# EAGLE design slothbot_2.0 (EAGLE 9.6.2)

## Sheet 1 of 2: Logical Components
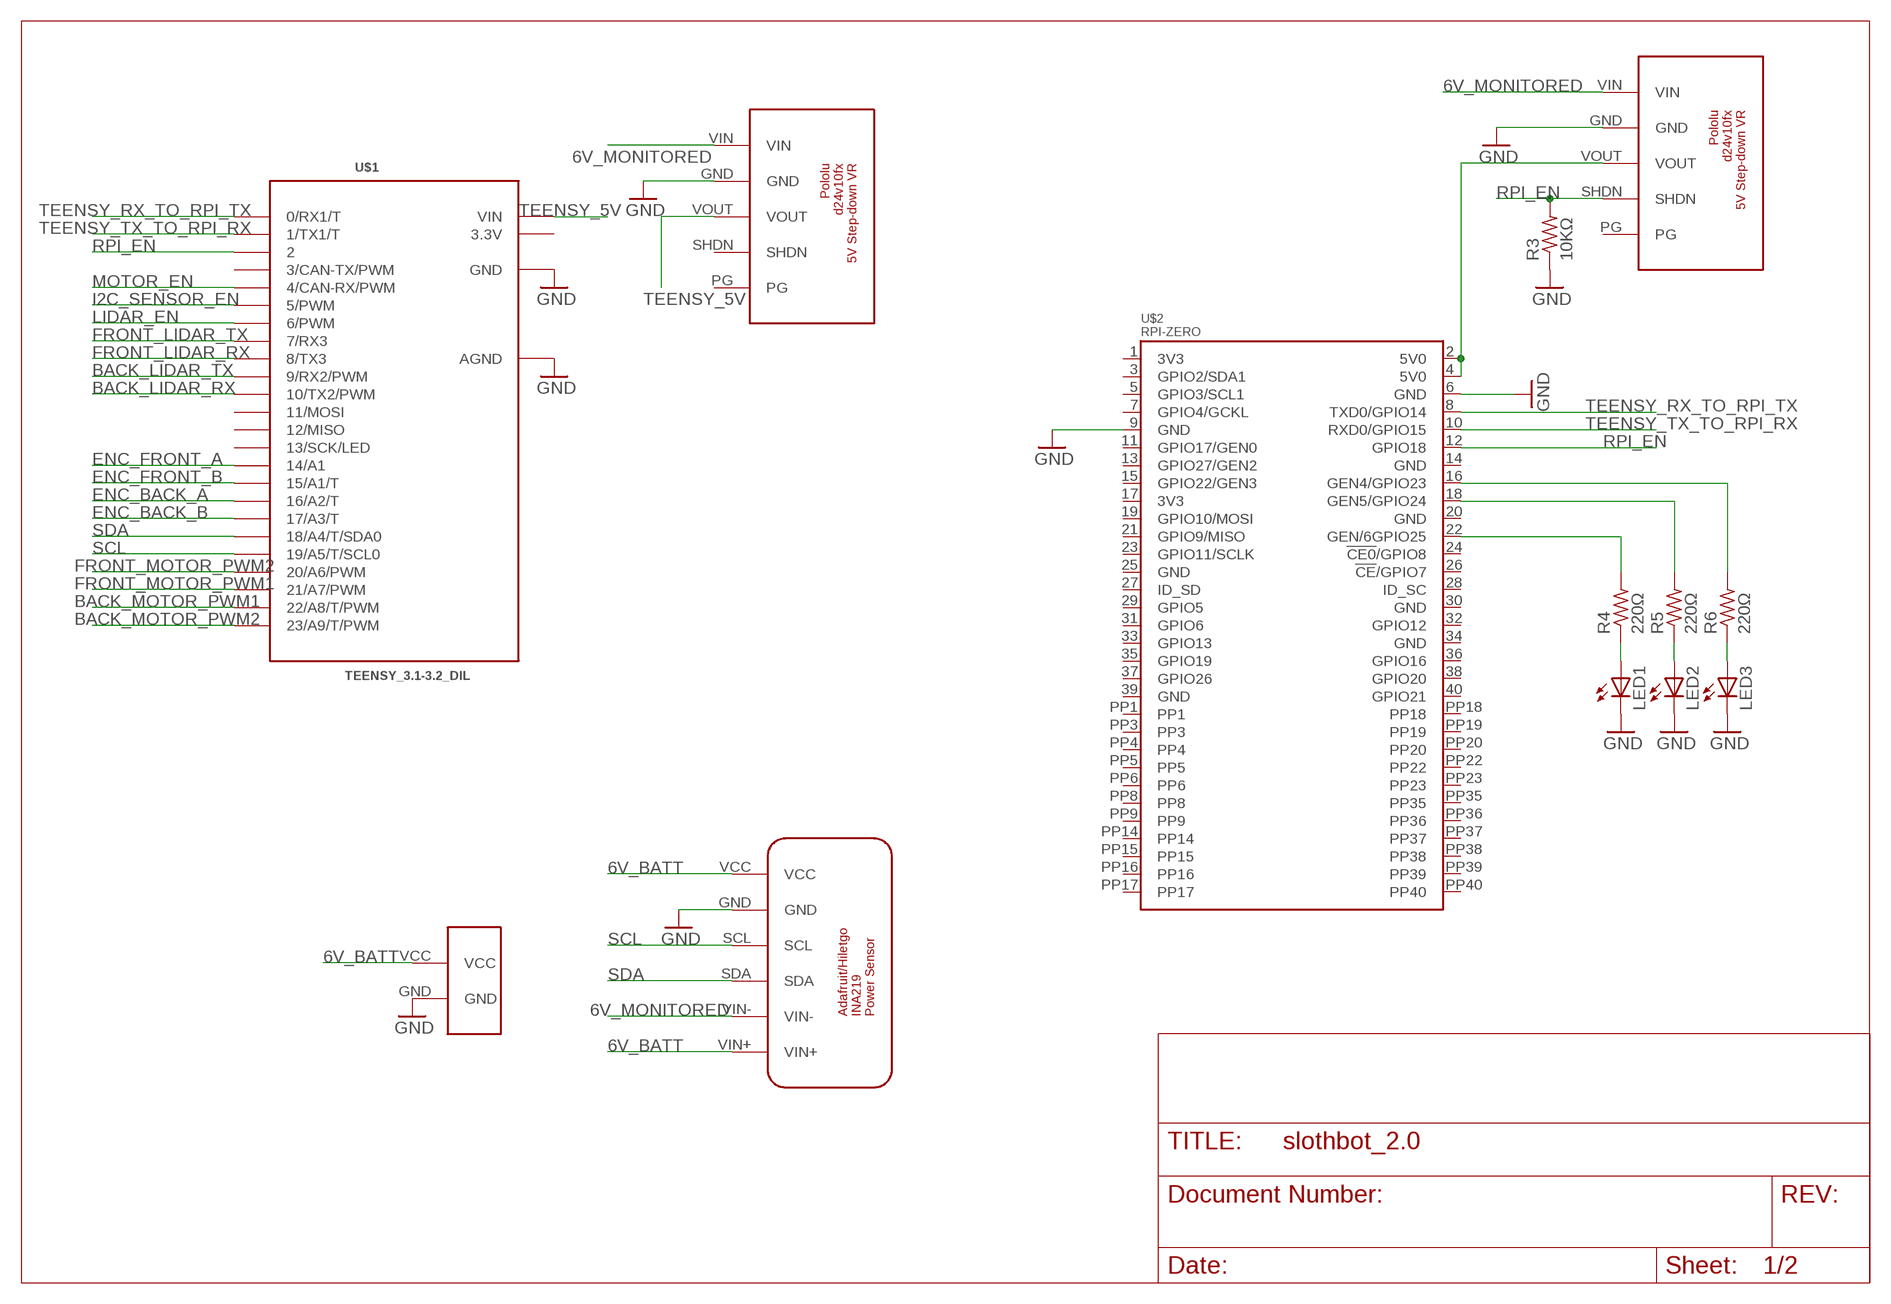
[diagram p0: schematic, sheet 1]

### Parts
LED1  LEDCHIPLED_0603  [CHIPLED_0603]
LED2  LEDCHIPLED_0603  [CHIPLED_0603]
LED3  LEDCHIPLED_0603  [CHIPLED_0603]
R3  10KΩ  R-US_R3216  [R3216]
R4  220Ω  R-US_R3216  [R3216]
R5  220Ω  R-US_R3216  [R3216]
R6  220Ω  R-US_R3216  [R3216]
U$1  TEENSY_3.1-3.2_DIL  [TEENSY_3.0-3.2&LC_DIL]
U$2  RPI-ZERO  [RASP_PI_ZERO_BOARD_FULL]
U$12  D24V10FX  [D24V10FX]
U$13  D24V10FX  [D24V10FX]
U$15  INA219  [INA219]
U$16  BATTERY_CONNECTOR  [BATTERY_CONNECTOR]

### Nets
5V0@1: U$2.2(5V0) U$2.4(5V0) U$13.VOUT
6V_BATT: U$15.VCC U$15.VIN+ U$16.VCC
6V_MONITORED: U$12.VIN U$13.VIN U$15.VIN- ; also sheet 2
BACK_LIDAR_RX: U$1.10(10/TX2/PWM) ; also sheet 2
BACK_LIDAR_TX: U$1.9(9/RX2/PWM) ; also sheet 2
BACK_MOTOR_PWM1: U$1.22/A8(22/A8/T/PWM) ; also sheet 2
BACK_MOTOR_PWM2: U$1.23/A9(23/A9/T/PWM) ; also sheet 2
ENC_BACK_A: U$1.16/A2(16/A2/T) ; also sheet 2
ENC_BACK_B: U$1.17/A3(17/A3/T) ; also sheet 2
ENC_FRONT_A: U$1.14/A0(14/A1) ; also sheet 2
ENC_FRONT_B: U$1.15/A1(15/A1/T) ; also sheet 2
FRONT_LIDAR_RX: U$1.8(8/TX3) ; also sheet 2
FRONT_LIDAR_TX: U$1.7(7/RX3) ; also sheet 2
FRONT_MOTOR_PWM1: U$1.21/A7(21/A7/PWM) ; also sheet 2
FRONT_MOTOR_PWM2: U$1.20/A6(20/A6/PWM) ; also sheet 2
GND: LED1.C LED2.C LED3.C R3.1 U$1.AGND U$1.GND U$2.6(GND) U$12.GND U$13.GND U$15.GND U$16.GND ; also sheet 2
GND@1: U$2.9(GND) ; supply symbol labelled GND
I2C_SENSOR_EN: U$1.5(5/PWM) ; also sheet 2
LIDAR_EN: U$1.6(6/PWM) ; also sheet 2
MOTOR_EN: U$1.4(4/CAN-RX/PWM) ; also sheet 2
N$6: LED1.A R4.1
N$10: LED2.A R5.1
N$11: LED3.A R6.1
N$12: R6.2 U$2.16(GEN4/GPIO23)
N$13: R5.2 U$2.18(GEN5/GPIO24)
N$14: R4.2 U$2.22(GEN/6GPIO25)
RPI_EN: R3.2 U$1.2 U$2.12(GPIO18) U$13.SHDN
SCL: U$1.19/A5(19/A5/T/SCL0) U$15.SCL ; also sheet 2
SDA: U$1.18/A4(18/A4/T/SDA0) U$15.SDA ; also sheet 2
TEENSY_5V: U$1.VIN U$12.VOUT ; also sheet 2
TEENSY_RX_TO_RPI_TX: U$1.0(0/RX1/T) U$2.8(TXD0/GPIO14)
TEENSY_TX_TO_RPI_RX: U$1.1(1/TX1/T) U$2.10(RXD0/GPIO15)
Unconnected: U$1.3(3/CAN-TX/PWM) U$1.11(11/MOSI) U$1.12(12/MISO) U$1.13(13/SCK/LED) U$2.1(3V3) U$2.3(GPIO2/SDA1) U$2.5(GPIO3/SCL1) U$2.7(GPIO4/GCKL) U$2.11(GPIO17/GEN0) U$2.13(GPIO27/GEN2) U$2.14(GND) U$2.15(GPIO22/GEN3) U$2.17(3V3) U$2.19(GPIO10/MOSI) U$2.20(GND) U$2.21(GPIO9/MISO) U$2.23(GPIO11/SCLK) U$2.24(!CE0!/GPIO8) U$2.25(GND) U$2.26(!CE!/GPIO7) U$2.27(ID_SD) U$2.28(ID_SC) U$2.29(GPIO5) U$2.30(GND) U$2.31(GPIO6) U$2.32(GPIO12) U$2.33(GPIO13) U$2.34(GND) U$2.35(GPIO19) U$2.36(GPIO16) U$2.37(GPIO26) U$2.38(GPIO20) U$2.39(GND) U$2.40(GPIO21) U$2.PP1 U$2.PP3 U$2.PP4 U$2.PP5 U$2.PP6 U$2.PP8 U$2.PP9 U$2.PP14 U$2.PP15 U$2.PP16 U$2.PP17 U$2.PP18 U$2.PP19 U$2.PP20 U$2.PP22 U$2.PP23 U$2.PP35 U$2.PP36 U$2.PP37 U$2.PP38 U$2.PP39 U$2.PP40 U$12.PG U$12.SHDN U$13.PG

## Sheet 2 of 2: Sensor and motors
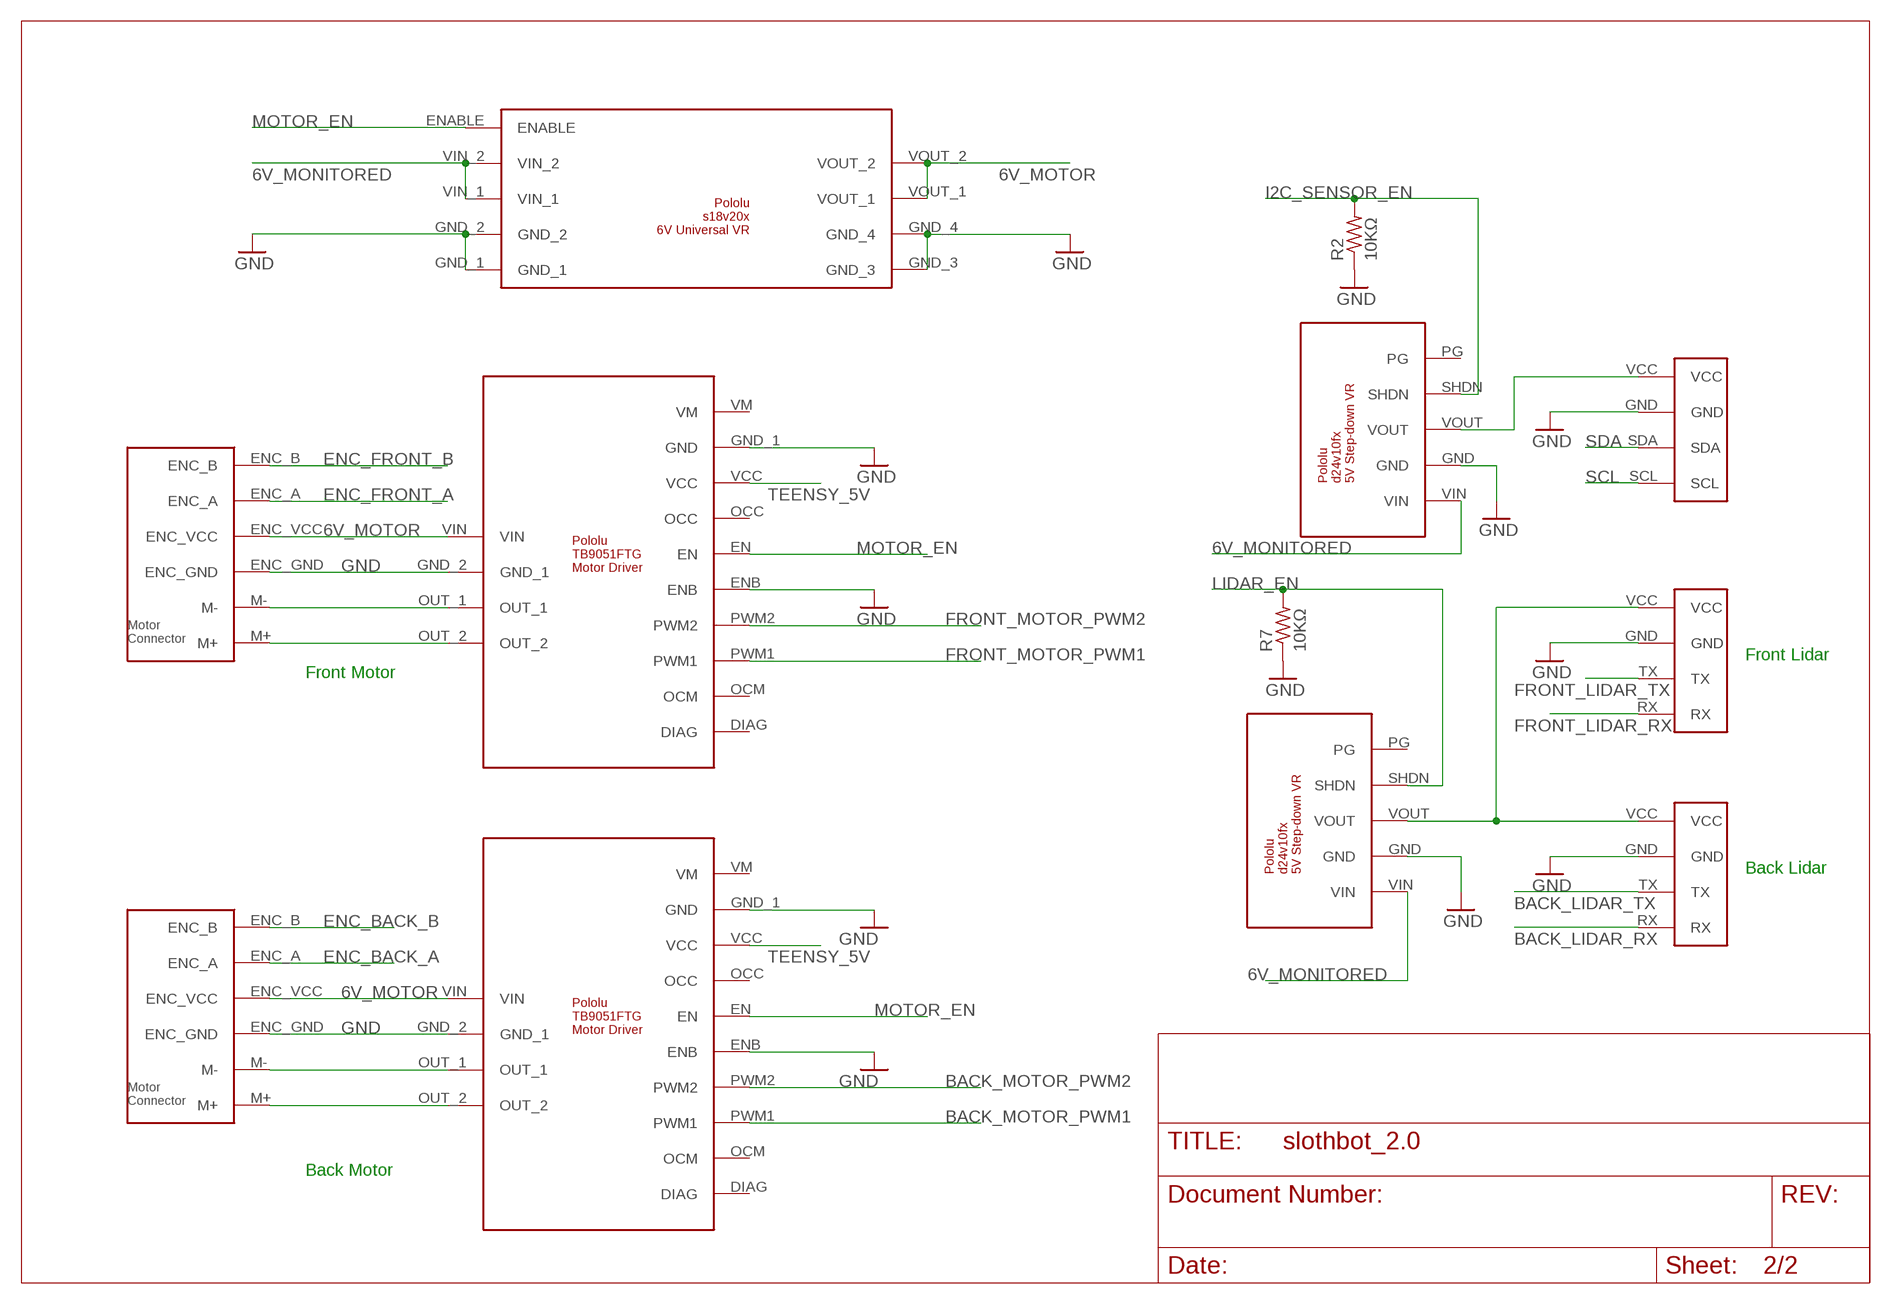
[diagram p1: schematic, sheet 2]

### Parts
R2  10KΩ  R-US_R3216  [R3216]
R7  10KΩ  R-US_R3216  [R3216]
U$3  D24V10FX  [D24V10FX]
U$4  MOTOR_CONNECTOR  [MOTOR_CONNECTOR]
U$5  MOTOR_CONNECTOR  [MOTOR_CONNECTOR]
U$6  SERIAL_CONNECTOR  [SERIAL_CONNECTOR]
U$7  SERIAL_CONNECTOR  [SERIAL_CONNECTOR]
U$8  I2C_CONNECTOR  [I2C_CONNECTOR]
U$9  TB9051FTG  [TB9051FTG]
U$10  TB9051FTG  [TB9051FTG]
U$11  S18V20X  [S18V20F6]
U$14  D24V10FX  [D24V10FX]

### Nets
6V_MONITORED: U$3.VIN U$11.VIN_1 U$11.VIN_2 U$14.VIN ; also sheet 1
6V_MOTOR: U$4.ENC_VCC U$5.ENC_VCC U$9.VIN U$10.VIN U$11.VOUT_1 U$11.VOUT_2
BACK_LIDAR_RX: U$6.RX ; also sheet 1
BACK_LIDAR_TX: U$6.TX ; also sheet 1
BACK_MOTOR_PWM1: U$10.PWM1 ; also sheet 1
BACK_MOTOR_PWM2: U$10.PWM2 ; also sheet 1
ENC_BACK_A: U$5.ENC_A ; also sheet 1
ENC_BACK_B: U$5.ENC_B ; also sheet 1
ENC_FRONT_A: U$4.ENC_A ; also sheet 1
ENC_FRONT_B: U$4.ENC_B ; also sheet 1
FRONT_LIDAR_RX: U$7.RX ; also sheet 1
FRONT_LIDAR_TX: U$7.TX ; also sheet 1
FRONT_MOTOR_PWM1: U$9.PWM1 ; also sheet 1
FRONT_MOTOR_PWM2: U$9.PWM2 ; also sheet 1
GND: R2.1 R7.1 U$3.GND U$4.ENC_GND U$5.ENC_GND U$6.GND U$7.GND U$8.GND U$9.ENB U$9.GND_1(GND) U$9.GND_2(GND_1) U$10.ENB U$10.GND_1(GND) U$10.GND_2(GND_1) U$11.GND_1 U$11.GND_2 U$11.GND_3 U$11.GND_4 U$14.GND ; also sheet 1
I2C_SENSOR_EN: R2.2 U$14.SHDN ; also sheet 1
LIDAR_EN: R7.2 U$3.SHDN ; also sheet 1
MOTOR_EN: U$9.EN U$10.EN U$11.ENABLE ; also sheet 1
N$2: U$3.VOUT U$6.VCC U$7.VCC
N$3: U$4.M- U$9.OUT_1
N$4: U$4.M+ U$9.OUT_2
N$7: U$5.M- U$10.OUT_1
N$8: U$5.M+ U$10.OUT_2
N$9: U$8.VCC U$14.VOUT
SCL: U$8.SCL ; also sheet 1
SDA: U$8.SDA ; also sheet 1
TEENSY_5V: U$9.VCC U$10.VCC ; also sheet 1
Unconnected: U$3.PG U$9.DIAG U$9.OCC U$9.OCM U$9.VM U$10.DIAG U$10.OCC U$10.OCM U$10.VM U$14.PG

### Notes on the sheet
- Front Lidar
- Front Motor
- Back Lidar
- Back Motor

## Power pins joined to a net without a drawn wire
3.3V: U$1.3.3V

## Library data of the parts
LED1-LED3 = adafruit:LED: LED OSRAM: - CHIPLED LG R971, LG N971, LY N971, LG Q971, LY Q971, LO R971, LY R971 LH N974, LH R974 LS Q976, LO Q976, LY Q976 LO Q996 - Hyper CHIPLED LW Q18S LB Q993, LB Q99A, LB R99A - SideLED LS A670, LO A670, LY A670, LG A670, LP A670 LB A673, LV A673, LT A673, LW A673 LH A674 LY A675 LS A676, LA A676, LO A676, LY A676, LW A676 LS A679, LY A679, LG A679 - Hyper Micro SIDELED® LS Y876, LA Y876, LO Y876, LY Y876 LT Y87S - SmartLED LW L88C, LW L88S LB L89C, LB L89S, LG L890 LS L89K, LO L89K, LY L89K LS L896, LA L896, LO L896, LY L896 - TOPLED LS T670, LO T670, LY T670, LG T670, LP T670 LSG T670, LSP T670, LSY T670, LOP T670, LYG T670 LG T671, LOG T671, LSG T671 LB T673, LV T673, LT T673, LW T673 LH T674 LS T676, LA T676, LO T676, LY T676, LB T676, LH T676, LSB T676, LW T676 LB T67C, LV T67C, LT T67C, LS T67K, LO T67K, LY T67K, LW E67C LS E67B, LA E67B, LO E67B, LY E67B, LB E67C, LV E67C, LT E67C LW T67C LS T679, LY T679, LG T679 LS T770, LO T770, LY T770, LG T770, LP T770 LB T773, LV T773, LT T773, LW T773 LH T774 LS E675, LA E675, LY E675, LS T675 LS T776, LA T776, LO T776, LY T776, LB T776 LHGB T686 LT T68C, LB T68C - Hyper Mini TOPLED® LB M676 - Mini TOPLED Santana® LG M470 LS M47K, LO M47K, LY M47K Source: http://www.osram.convergy.de/
R2-R7 = adafruit:R-US_: RESISTOR, American symbol
U$1 = Teensy_3_and_LC_Series_Boards_v1.4:TEENSY_3.1-3.2_DIL: Teensy 3.1 or 3.2 in a DIL Layout.
U$2 = rpi-zero:RPI-ZERO
U$3 U$12-U$14 = slothbot_parts:D24V10FX
U$4 U$5 = slothbot_parts:MOTOR_CONNECTOR
U$6 U$7 = slothbot_parts:SERIAL_CONNECTOR
U$8 = slothbot_parts:I2C_CONNECTOR
U$9 U$10 = slothbot_parts:TB9051FTG
U$11 = slothbot_parts:S18V20X
U$15 = slothbot_parts:INA219
U$16 = slothbot_parts:BATTERY_CONNECTOR

## Board
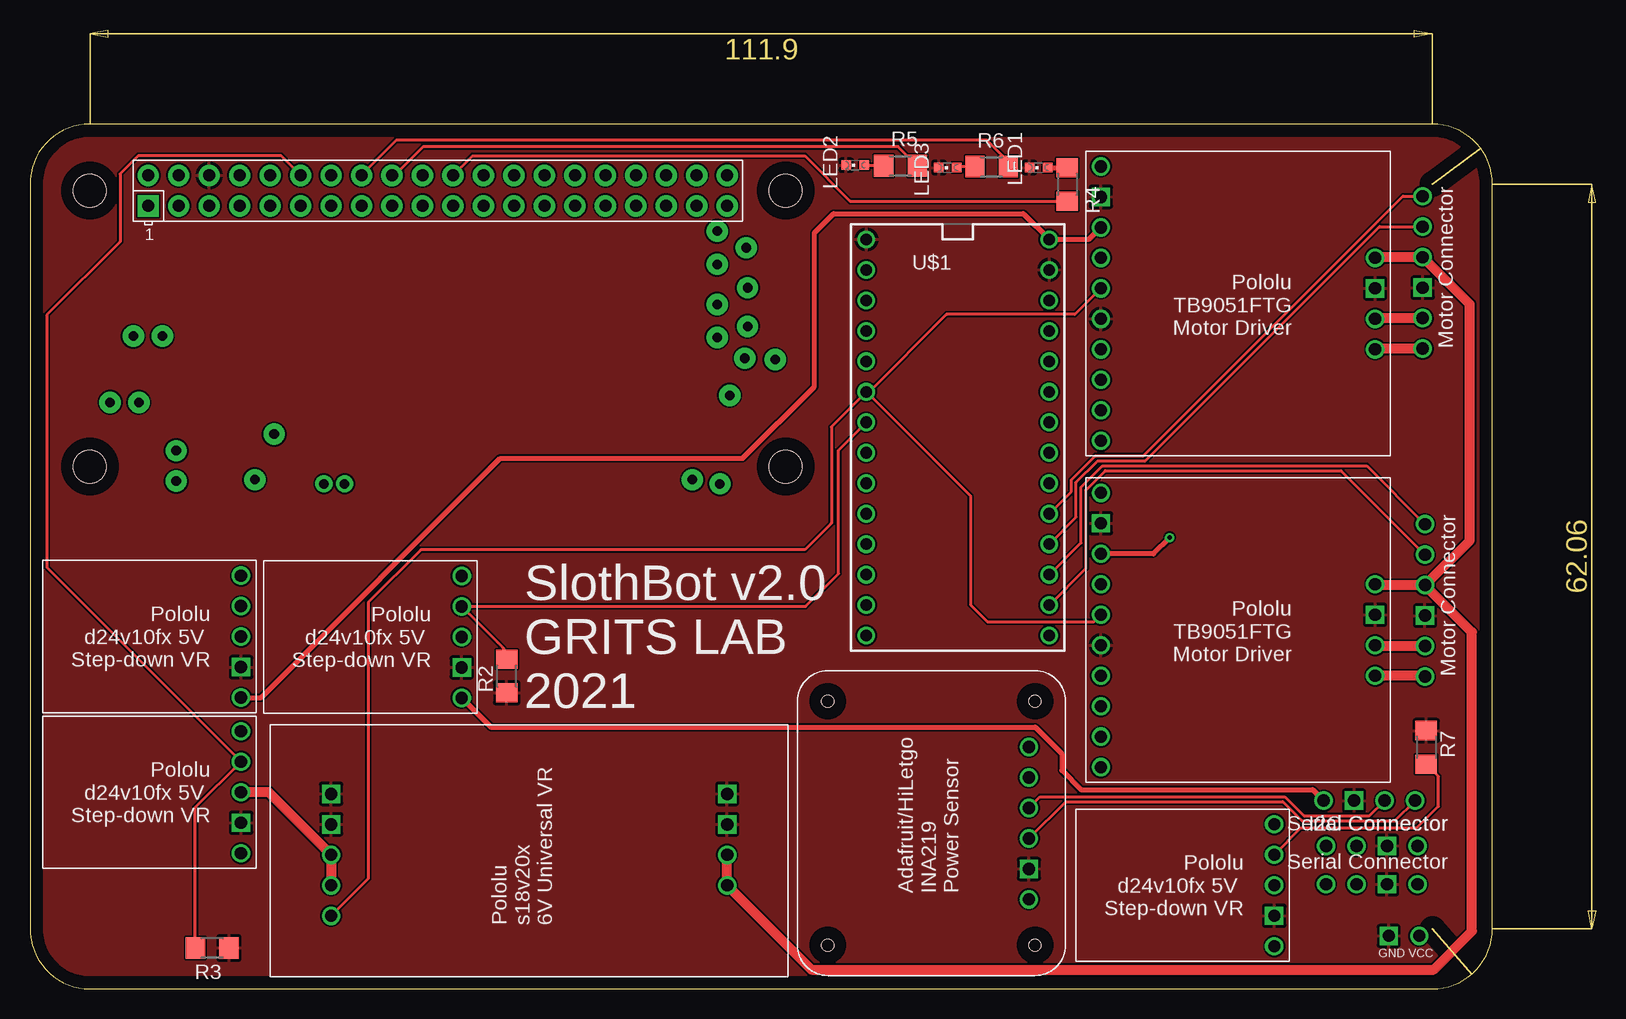
[diagram p2: board, top side]
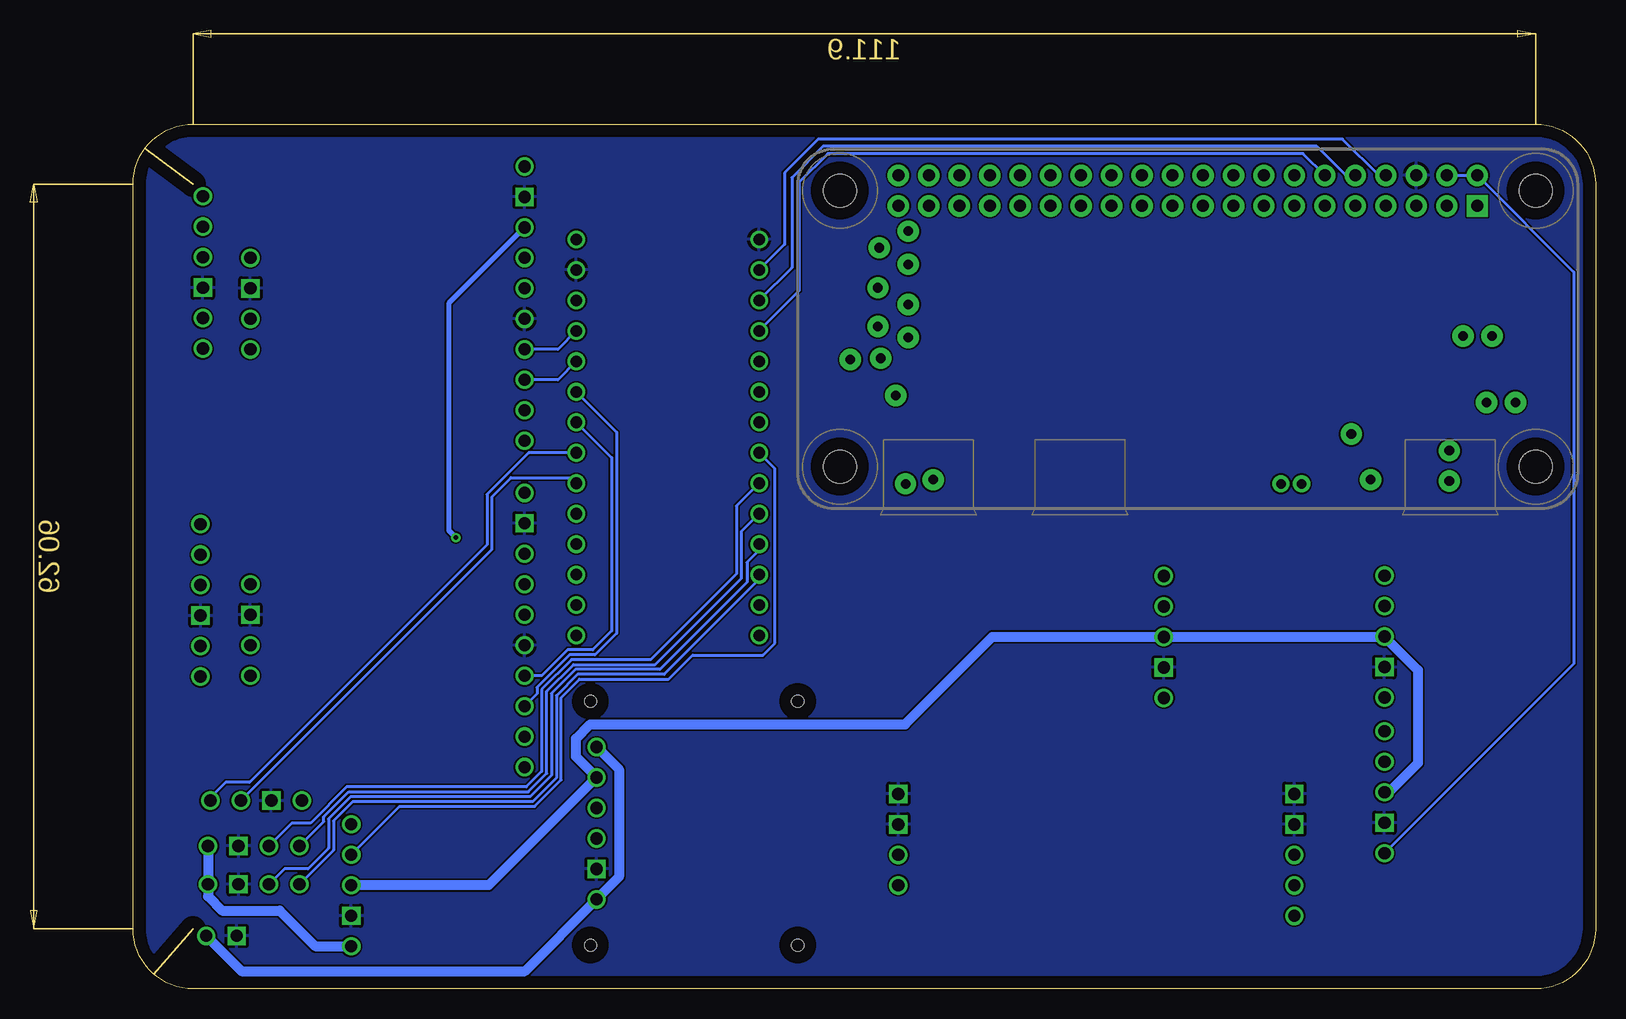
[diagram p3: board, bottom side, seen from below]

Size 121.9 x 72.06 mm. Coordinates in mm from the lower left corner, seen from the top.
Outline: 0,5 arc90 5,0 116.9,0 arc90 121.9,5 121.9,67.06 arc90 116.9,72.06 5,72.06 arc90 0,67.06 0,5
Copper layers (1*16): Top 0.035mm / dielectric 1.5mm / Bottom 0.035mm
Design rules "default": minimum track width 6mil, minimum drill 0.35mm, track to track 6mil, track to pad 6mil, pad to pad 6mil, via to via 6mil, smd to smd 6mil, copper to edge 40mil, drill to drill 6mil, minimum pad ring 10mil, minimum via ring 8mil, stop-mask expansion 4mil, vias tented up to drill 0mil, thermal gap 10mil

### Footprints (pad centres in the part's own frame; a part is rotated, then mirrored left to right if it is on the bottom)
CHIPLED_0603 = smd 0.8 x 0.8: A 0,-0.75; C 0,0.75
R3216 = smd 1.6 x 1.8: 1 -1.4,0; 2 1.4,0
TEENSY_3.0-3.2&LC_DIL = drill 0.965: 0 -7.62,13.97; 1 -7.62,11.43; 2 -7.62,8.89; 3 -7.62,6.35; 3.3V 7.62,11.43; 4 -7.62,3.81; 5 -7.62,1.27; 6 -7.62,-1.27; 7 -7.62,-3.81; 8 -7.62,-6.35; 9 -7.62,-8.89; 10 -7.62,-11.43; 11 -7.62,-13.97; 12 -7.62,-16.51; 13 7.62,-16.51; 14/A0 7.62,-13.97; 15/A1 7.62,-11.43; 16/A2 7.62,-8.89; 17/A3 7.62,-6.35; 18/A4 7.62,-3.81; 19/A5 7.62,-1.27; 20/A6 7.62,1.27; 21/A7 7.62,3.81; 22/A8 7.62,6.35; 23/A9 7.62,8.89; AGND 7.62,13.97; GND -7.62,16.51; VIN 7.62,16.51
RASP_PI_ZERO_BOARD_FULL = drill 1 pad 1.778 square: 1 8.37,25.23 | drill 1 pad 1.778: 2 8.37,27.77; 3 10.91,25.23; 4 10.91,27.77; 5 13.45,25.23; 6 13.45,27.77; 7 15.99,25.23; 8 15.99,27.77; 9 18.53,25.23; 10 18.53,27.77; 11 21.07,25.23; 12 21.07,27.77; 13 23.61,25.23; 14 23.61,27.77; 15 26.15,25.23; 16 26.15,27.77; 17 28.69,25.23; 18 28.69,27.77; 19 31.23,25.23; 20 31.23,27.77; 21 33.77,25.23; 22 33.77,27.77; 23 36.31,25.23; 24 36.31,27.77; 25 38.85,25.23; 26 38.85,27.77; 27 41.39,25.23; 28 41.39,27.77; 29 43.93,25.23; 30 43.93,27.77; 31 46.47,25.23; 32 46.47,27.77; 33 49.01,25.23; 34 49.01,27.77; 35 51.55,25.23; 36 51.55,27.77; 37 54.09,25.23; 38 54.09,27.77; 39 56.63,25.23; 40 56.63,27.77 | drill 0.8 pad 1.778: PP1 10.699,4.832; PP3 7.593,8.858; PP4 7.133,14.38; PP5 55.796,23.124; PP6 10.699,2.301; PP8 5.177,8.858; PP9 9.549,14.38; PP14 58.327,18.407; PP15 55.796,14.265; PP16 55.796,20.363; PP17 58.212,21.743; PP18 55.796,17.027; PP19 58.327,15.186; PP20 56.832,9.434; PP35 17.257,2.416; PP36 60.628,12.425; PP37 56.026,2.071; PP38 53.726,2.416; PP39 58.097,12.54; PP40 18.867,6.212 | drill 0.8 pad 1.422: PP22 23.009,2.071; PP23 24.734,2.071 | hole 2.75: 3.5,3.5; 3.5,26.5; 61.5,3.5; 61.5,26.5
D24V10FX = drill 1.02 square: GND 1.27,8.89 | drill 1.02: PG 1.27,1.27; SHDN 1.27,3.81; VIN 1.27,6.35; VOUT 1.27,11.43
MOTOR_CONNECTOR = drill 1.02: ENC_A 10.16,0; ENC_B 12.7,0; ENC_VCC 7.62,0; M+ 0,0; M- 2.54,0 | drill 1.02 square: ENC_GND 5.08,0
SERIAL_CONNECTOR = drill 1.02 square: GND 2.54,0 | drill 1.02: RX 7.62,0; TX 5.08,0; VCC 0,0
I2C_CONNECTOR = drill 1.02 square: GND 2.54,0 | drill 1.02: SCL 7.62,0; SDA 5.08,0; VCC 0,0
TB9051FTG = drill 1.02: DIAG 24.13,24.13; EN 24.13,11.43; ENB 24.13,13.97; OCC 24.13,8.89; OCM 24.13,21.59; OUT_1 1.27,13.97; OUT_2 1.27,16.51; PWM1 24.13,19.05; PWM2 24.13,16.51; VCC 24.13,6.35; VIN 1.27,8.89; VM 24.13,1.27 | drill 1.02 square: GND_1 1.27,11.43; GND_2 24.13,3.81
S18V20F6 = drill 1.02: ENABLE 5.08,38.1; VIN_1 10.16,38.1; VIN_2 7.62,38.1; VOUT_1 10.16,5.08; VOUT_2 7.62,5.08 | drill 1.02 square: GND_1 15.24,38.1; GND_2 12.7,38.1; GND_3 15.24,5.08; GND_4 12.7,5.08
INA219 = drill 1.016 square: GND -3.81,-17.272 | drill 1.016: SCL -1.27,-17.272; SDA 1.27,-17.272; VCC -6.35,-17.272; VIN+ 6.35,-17.272; VIN- 3.81,-17.272 | hole 1: -10.16,-17.78; 10.16,-0.508; -10.16,-0.508; 10.16,-17.78
BATTERY_CONNECTOR = drill 1 square: GND 2.54,0 | drill 1: VCC 0,0

### Placement (x,y rotation side)
LED1  84.07,68.44 90 top
LED2  68.79,68.64 90 top
LED3  76.51,68.44 90 top
R2  39.74,26.07 90 top
R3  15.19,3.4 180 top
R4  86.47,67.03 270 top
R5  72.57,68.59 0 top
R6  80.17,68.51 0 top
R7  116.39,20.12 270 top
U$1  77.34,45.94 0 top
U$2  1.49,40.01 0 top
U$3  104.99,14.98 180 top
U$4  116.29,26.02 90 top
U$5  116.09,53.35 90 top
U$6  115.66,8.71 180 top
U$7  115.66,11.9 180 top
U$8  107.84,15.69 0 top
U$9  113.4,42.6 180 top
U$10  113.4,69.8 180 top
U$11  63.2,1 90 top
U$12  18.86,35.7 180 top
U$13  18.86,22.73 180 top
U$14  37.26,35.67 180 top
U$15  66,13.8 90 top
U$16  115.8,4.4 180 top

### Tracks (layer width: path | path; a pad name or v marks a point on that pad's centre or on a via)
5V0@1
  Bottom 0.254: U$2.4 U$2.2 1.8,59.72 1.8,27.09 U$13.VOUT
6V_BATT
  Bottom 0.813: U$16.VCC 112.87,1.47 89.25,1.47 U$15.VCC 81.4,9.32 81.4,18.28 U$15.VIN+
6V_MONITORED
  Top 0.813: U$11.VIN_2 U$11.VIN_1 19.88,16.38 U$13.VIN
  Bottom 0.813: U$3.VIN 92.25,8.63 U$15.VIN- 85,19.34 85,20.84 83.8,22.04 57.56,22.04 50.28,29.32 U$14.VIN 17.62,29.32 U$12.VIN 14.8,26.56 14.8,18.8 17.22,16.38 U$13.VIN
6V_MOTOR
  Top 0.813: U$4.ENC_VCC 120.2,29.73 120.2,4.8 117,1.6 65.14,1.6 U$11.VOUT_2 U$11.VOUT_1 | U$4.ENC_VCC 112.2,33.64 U$9.VIN | U$10.VIN 112.19,60.97 U$5.ENC_VCC 120,57.06 120,37.35 U$4.ENC_VCC
BACK_LIDAR_RX
  Bottom 0.254: U$1.10 69.72,34.11 77.63,26.2 84.86,26.2 86.62,24.44 86.62,17.58 88.6,15.6 103.6,15.6 105.2,14 105.2,11.55 U$6.RX
BACK_LIDAR_TX
  Bottom 0.254: U$1.9 69.72,36.55 70.74,35.53 70.74,33.86 77.99,26.61 85.03,26.61 87.03,24.61 87.03,17.78 88.8,16.01 103.77,16.01 105.61,14.17 105.61,11.72 107.33,10 109.29,10 U$6.TX
BACK_MOTOR_PWM1
  Bottom 0.254: U$1.22/A8 86.5,50.75 U$10.PWM1
BACK_MOTOR_PWM2
  Bottom 0.254: U$1.23/A9 86.5,53.29 U$10.PWM2
ENC_BACK_A
  Top 0.254: U$1.16/A2 87.21,39.3 87.21,42.2 89,43.99 92.97,43.99 112.48,63.51 U$5.ENC_A
ENC_BACK_B
  Top 0.254: U$1.17/A3 86.8,41.43 86.8,42.4 88.8,44.4 92.8,44.4 114.45,66.05 U$5.ENC_B
ENC_FRONT_A
  Top 0.254: U$1.14/A0 88.02,35.03 88.02,41.56 89.64,43.18 109.29,43.18 U$4.ENC_A
ENC_FRONT_B
  Top 0.254: U$1.15/A1 87.61,37.16 87.61,41.8 89.4,43.59 111.42,43.59 U$4.ENC_B
FRONT_LIDAR_RX
  Bottom 0.254: U$7.RX 106.01,13.93 106.01,14.34 103.94,16.41 88.97,16.41 87.44,17.95 87.44,24.78 85.2,27.02 78.38,27.02 71.2,34.2 71.2,38.11 U$1.8
FRONT_LIDAR_TX
  Bottom 0.254: U$1.7 71.61,40.24 71.61,34.57 78.75,27.42 85.37,27.42 87.84,24.95 87.84,18.11 89.14,16.82 104.11,16.82 107.12,13.8 108.68,13.8 U$7.TX
FRONT_MOTOR_PWM1
  Bottom 0.254: U$1.21/A7 81.6,46.39 81.6,29.63 83.4,27.83 85.53,27.83 88.25,25.11 88.25,24.57 U$9.PWM1
FRONT_MOTOR_PWM2
  Bottom 0.254: U$1.20/A6 82.01,44.26 82.01,29.83 83.6,28.23 85.7,28.23 87.85,26.09 U$9.PWM2
GND
  pour Top: -3.81,114.3 -19.05,99.06 -19.05,97.79 -19.05,8.89 6.35,-16.51 158.75,-16.51 177.8,2.54 177.8,92.71 158.75,111.76 156.21,114.3
  pour Bottom: -3.81,105.41 -10.16,99.06 -10.16,11.43 -10.16,3.81 7.62,-13.97 154.94,-13.97 172.72,3.81 172.72,91.44 171.45,92.71 154.94,109.22 152.4,109.22 0,109.22
I2C_SENSOR_EN
  Top 0.254: R2.2 39.44,28.41 U$14.SHDN 64.66,31.86 67.4,34.6 67.4,44.89 U$1.5
LIDAR_EN
  Top 0.254: U$3.SHDN 105.95,13.4 115.6,13.4 117.4,15.2 117.4,17.71 R7.2
  Bottom 0.254: U$3.SHDN 99.7,15.19 88.43,15.19 86.22,17.41 86.22,24.27 84.69,25.8 77.26,25.8 75.25,27.8 69.4,27.8 68.4,28.8 68.4,43.35 U$1.6
MOTOR_EN
  Top 0.254: 69.83,49.63 U$1.4 66.8,46.83 66.8,38.8 64.6,36.6 32.6,36.6 28.2,32.2 28.2,9.18 U$11.ENABLE | 69.83,49.63 78.4,41.07 78.4,32 79.8,30.6 88.7,30.6 U$9.EN | U$10.EN 87.1,56.2 76.4,56.2 69.83,49.63
N$2
  Bottom 0.813: U$7.VCC U$6.VCC 115.66,7.71 114.46,6.51 109.67,6.51 106.71,3.55 U$3.VOUT
N$3
  Top 0.813: U$4.M- 112.2,28.56 U$9.OUT_1
N$4
  Top 0.813: U$4.M+ 116.22,26.09 U$9.OUT_2
N$6
  Top 0.406: LED1.A R4.1
N$7
  Top 0.813: U$5.M- 112.19,55.89 U$10.OUT_1
N$8
  Top 0.813: U$5.M+ 112.19,53.35 U$10.OUT_2
N$9
  Top 0.406: U$14.VOUT 38.43,21.8 83.8,21.8 86,19.6 86,18.2 87.6,16.6 106.93,16.6 U$8.VCC
N$10
  Top 0.254: R5.1 69.59,68.59 LED2.A
N$11
  Top 0.254: R6.1 77.33,68.51 LED3.A
N$12
  Top 0.254: U$2.16 27.64,67.84 30.51,70.71 79.77,70.71 81.57,68.91 R6.2
N$13
  Top 0.254: R5.2 72.37,70.19 32.79,70.19 30.38,67.78 U$2.18
N$14
  Top 0.254: R4.2 68.37,65.63 64.6,69.4 36.88,69.4 U$2.22
RPI_EN
  Top 0.254: R3.2 13.79,15.12 U$13.SHDN 1.4,35.11 1.4,56.16 7.51,62.27 7.51,67.91 9,69.4 20.94,69.4 U$2.12
  Bottom 0.254: U$2.12 24.38,69.6 64,69.6 66.4,67.2 66.4,58.15 U$1.2
SCL
  Top 0.254: U$15.SCL 86.34,15.59 104.43,15.59 106.03,13.99 113.76,13.99 U$8.SCL
  Bottom 0.254: U$1.19/A5 88.93,44.67 92.41,41.19 92.41,37 112.21,17.2 114.2,17.2 115.46,15.94 U$8.SCL
SDA
  Top 0.254: U$15.SDA 84.2,16 104.6,16 106.2,14.4 111.63,14.4 U$8.SDA
  Bottom 0.254: U$8.SDA 92,36.61 92,41 90.4,42.6 85.43,42.6 U$1.18/A4
TEENSY_5V  (via drill 0.35)
  Top 0.406: U$12.VOUT 19.27,24.27 39.2,44.2 59.4,44.2 65.38,50.18 65.38,63 66.98,64.6 82.81,64.6 U$1.VIN 88.27,62.45 U$10.VCC | v95,37.6 93.65,36.25 U$9.VCC
  Bottom 0.406: U$10.VCC 95.6,57.12 95.6,38.2 v95,37.6
TEENSY_RX_TO_RPI_TX
  Bottom 0.254: U$2.8 18.08,67.78 21.1,70.8 64.8,70.8 67.6,68 67.6,62.03 U$1.0
TEENSY_TX_TO_RPI_RX
  Bottom 0.254: U$2.10 20.82,67.78 23.24,70.2 64.4,70.2 67,67.6 67,60.09 U$1.1

### Text on the board
tNames: SlothBot v2.0 / GRITS LAB / 2021 | GND VCC